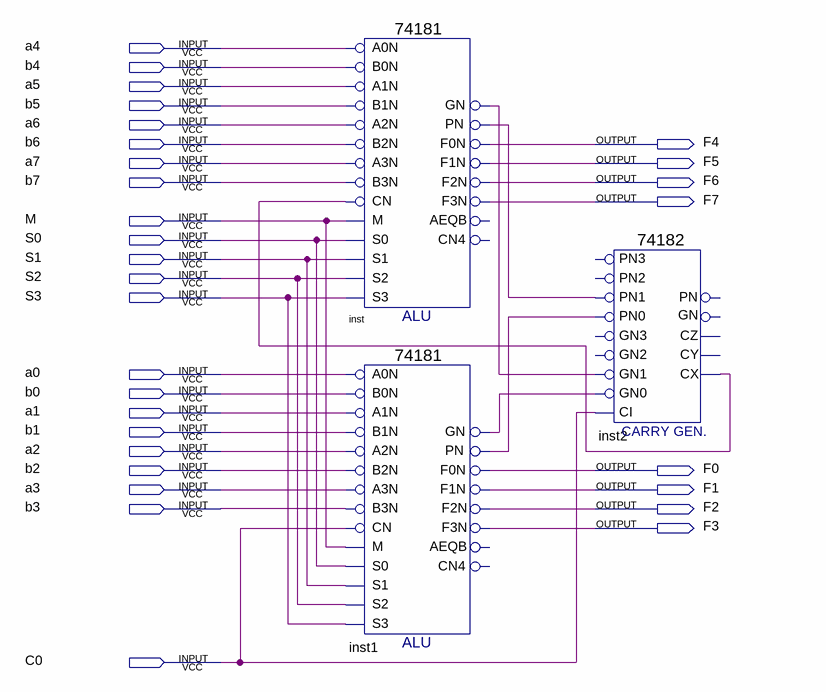
[diagram p0: schematic sheet]
// Quartus schematic 8ALU.bdf as structural Verilog: 3 symbols, 30 pins
module \8ALU  (
  input  a4,
  input  b4,
  input  a5,
  input  b5,
  input  a6,
  input  b6,
  input  a7,
  input  b7,
  input  M,
  input  S0,
  input  S1,
  input  S2,
  input  S3,
  input  a0,
  input  b0,
  input  a1,
  input  b1,
  input  a2,
  input  b2,
  input  a3,
  input  b3,
  input  C0,
  output F4,
  output F5,
  output F6,
  output F7,
  output F0,
  output F1,
  output F2,
  output F3
);

  wire inst1_gn, inst1_pn, inst2_cx, inst_gn, inst_pn;

  \74181  inst (
    .B0N(b4), .A0N(a4), .A1N(a5), .B1N(b5), .A3N(a7), .B2N(b6), .A2N(a6), .M(M), .CN(inst2_cx), .B3N(b7),
    .S2(S2), .S1(S1), .S0(S0), .S3(S3), .PN(inst_pn), .GN(inst_gn), .F3N(F7), .F1N(F5), .F0N(F4), .F2N(F6));  // open: AEQB, CN4
  \74181  inst1 (
    .B0N(b0), .A0N(a0), .A1N(a1), .B1N(b1), .A3N(a3), .B2N(b2), .A2N(a2), .M(M), .CN(C0), .B3N(b3), .S2(S2),
    .S1(S1), .S0(S0), .S3(S3), .PN(inst1_pn), .GN(inst1_gn), .F3N(F3), .F1N(F1), .F0N(F0), .F2N(F2));  // open: AEQB, CN4
  \74182  inst2 (
    .CI(C0), .PN1(inst_pn), .PN0(inst1_pn), .GN1(inst_gn), .GN0(inst1_gn), .CX(inst2_cx));  // open: PN2, GN2, GN3, PN3, CY, PN, CZ, GN
endmodule
